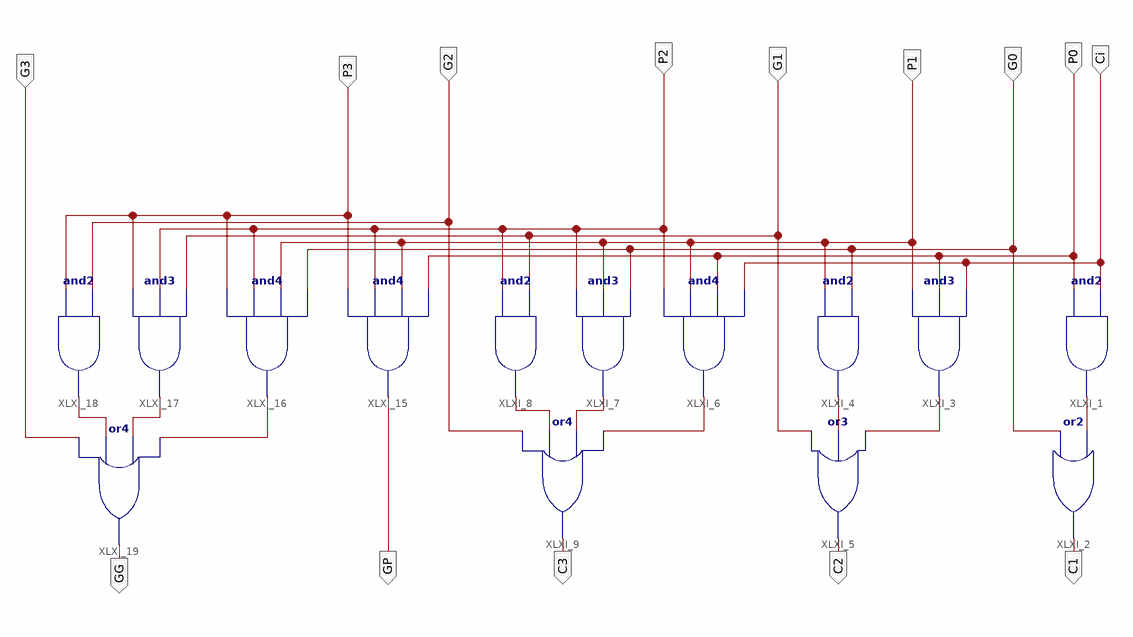
[diagram p0: schematic sheet 1]
// Xilinx ISE schematic CLA.sch (kintex7) as structural Verilog: 14 symbols, 14 ports
module CLA (
  input  Ci,
  input  P0,
  input  G0,
  input  P1,
  input  G1,
  input  P2,
  input  G2,
  input  P3,
  input  G3,
  output GP,
  output GG,
  output C3,
  output C2,
  output C1
);

  wire XLXN_33, XLXN_35, XLXN_36, XLXN_43, XLXN_44, XLXN_45, XLXN_63, XLXN_64, XLXN_65;

  and XLXI_1 (XLXN_33, P0, Ci);
  or XLXI_2 (C1, G0, XLXN_33);
  and XLXI_3 (XLXN_36, P1, P0, Ci);
  and XLXI_4 (XLXN_35, P1, G0);
  or XLXI_5 (C2, G1, XLXN_35, XLXN_36);
  and XLXI_6 (XLXN_43, P2, P1, P0, Ci);
  and XLXI_7 (XLXN_44, P2, P1, G0);
  and XLXI_8 (XLXN_45, P2, G1);
  or XLXI_9 (C3, G2, XLXN_45, XLXN_44, XLXN_43);
  and XLXI_15 (GP, P3, P2, P1, P0);
  and XLXI_16 (XLXN_65, P3, P2, P1, G0);
  and XLXI_17 (XLXN_64, P3, P2, G1);
  and XLXI_18 (XLXN_63, P3, G2);
  or XLXI_19 (GG, G3, XLXN_63, XLXN_64, XLXN_65);
endmodule
